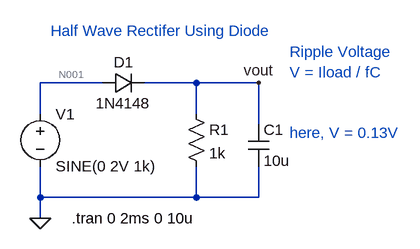
[diagram p0: schematic half_wave_rectifier.asc]
half_wave_rectifier.asc, the LTspice schematic file:
Version 4.1
SHEET 1 880 680
WIRE 128 144 32 144
WIRE 272 144 192 144
WIRE 368 144 272 144
WIRE 32 192 32 144
WIRE 272 192 272 144
WIRE 368 208 368 144
WIRE 32 320 32 272
WIRE 272 320 272 272
WIRE 272 320 32 320
WIRE 368 320 368 272
WIRE 368 320 272 320
WIRE 32 352 32 320
FLAG 32 352 0
FLAG 368 144 vout
SYMBOL diode 128 160 R270
WINDOW 0 32 32 VTop 2
WINDOW 3 0 32 VBottom 2
SYMATTR InstName D1
SYMATTR Value 1N4148
SYMBOL voltage 32 176 R0
WINDOW 123 0 0 Left 0
WINDOW 39 0 0 Left 0
SYMATTR InstName V1
SYMATTR Value SINE(0 2V 1k)
SYMBOL res 256 176 R0
SYMATTR InstName R1
SYMATTR Value 1k
SYMBOL cap 352 208 R0
SYMATTR InstName C1
SYMATTR Value 10u
TEXT 48 64 Left 2 ;Half Wave Rectifer Using Diode
TEXT 80 352 Left 2 !.tran 0 2ms 0 10u
TEXT 416 96 Left 2 ;Ripple Voltage \nV = Iload / fC\n \n\nhere, V = 0.13V

The netlist it stands for:
* half_wave_rectifier.asc
D1 N001 vout 1N4148
V1 N001 0 SINE(0 2V 1k)
R1 vout 0 1k
C1 vout 0 10u
.model D D
.lib standard.dio
* Half Wave Rectifer Using Diode
.tran 0 2ms 0 10u
* Ripple Voltage
* V = Iload / fC
* here, V = 0.13V
.backanno
.end

* Results of the author's LTspice run, read from the files saved beside the schematic
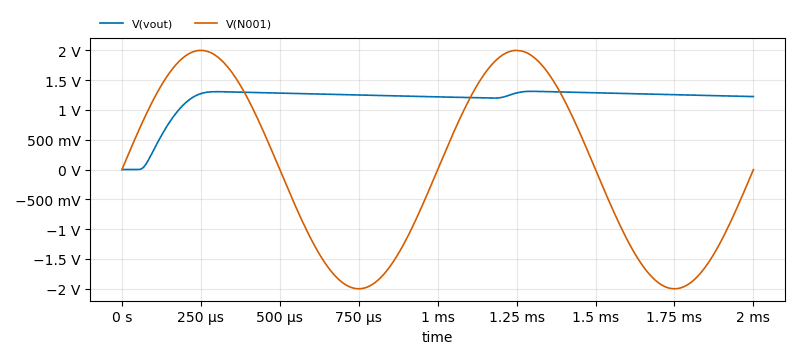
[diagram p1: Transient Analysis of half_wave_rectifier.asc, plotted from the saved traces]
* Transient Analysis, 1 run:
*   V(vout): min 0 V, max 1.313 V, average 1.174 V, rms 1.209 V, last 1.225 V
*   V(N001): min -2 V, max 2 V, average 3.526 µV, rms 1.414 V, last 0 V